# Altium schematic sheet Intelligent_Agriculture_Top.SchDoc
size A4
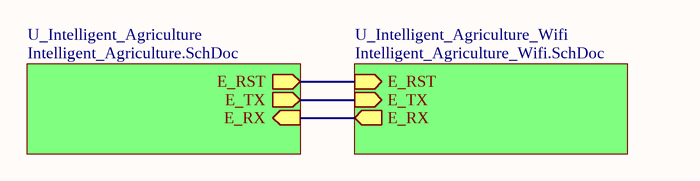
[diagram p0: Intelligent_Agriculture_Top.SchDoc]

## Sub-sheets
U_Intelligent_Agriculture = Intelligent_Agriculture.SchDoc: E_RST (out), E_TX (out), E_RX (in)
U_Intelligent_Agriculture_Wifi = Intelligent_Agriculture_Wifi.SchDoc: E_RST (in), E_TX (in), E_RX (out)

## Nets
(unnamed): sheet U_Intelligent_Agriculture/E_RST, sheet U_Intelligent_Agriculture_Wifi/E_RST
(unnamed): sheet U_Intelligent_Agriculture/E_TX, sheet U_Intelligent_Agriculture_Wifi/E_TX
(unnamed): sheet U_Intelligent_Agriculture/E_RX, sheet U_Intelligent_Agriculture_Wifi/E_RX